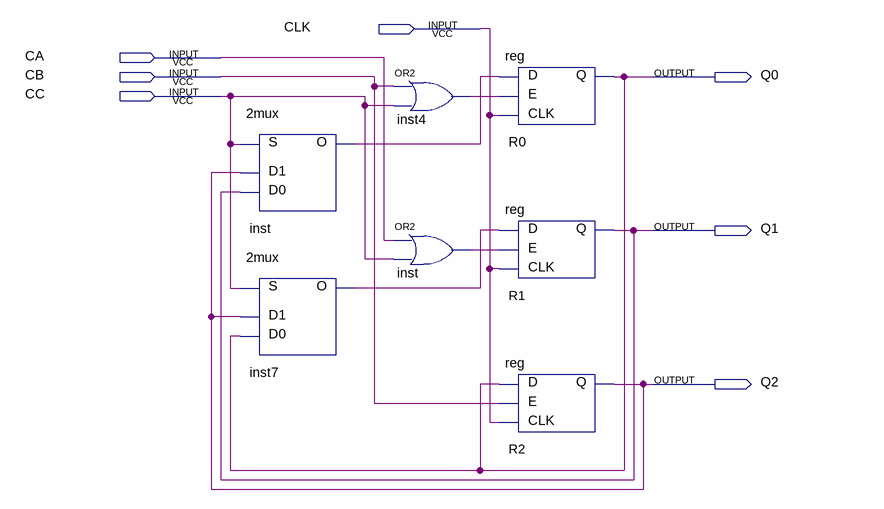
[diagram p0: schematic sheet]
// Quartus schematic hw12p2a.bdf as structural Verilog: 7 symbols, 7 pins
module hw12p2a (
  input  CLK,
  input  CA,
  input  CB,
  input  CC,
  output Q0,
  output Q1,
  output Q2
);

  wire inst4_out, inst7_o, inst_o, inst_out;

  \2mux  inst (.D1(Q2), .D0(Q1), .S(CC), .O(inst_o));
  \2mux  inst7 (.D1(Q2), .D0(Q0), .S(CC), .O(inst7_o));
  or inst4 (inst4_out, CB, CC);
  or inst_dup2 (inst_out, CA, CC);
  \reg  R0 (.E(inst4_out), .D(inst_o), .CLK(CLK), .Q(Q0));
  \reg  R1 (.E(inst_out), .D(inst7_o), .CLK(CLK), .Q(Q1));
  \reg  R2 (.E(CB), .D(Q0), .CLK(CLK), .Q(Q2));
endmodule
